# Altium schematic sheet Navigation switches.SchDoc
size A; SheetNumber: 13; SheetTotal: 14
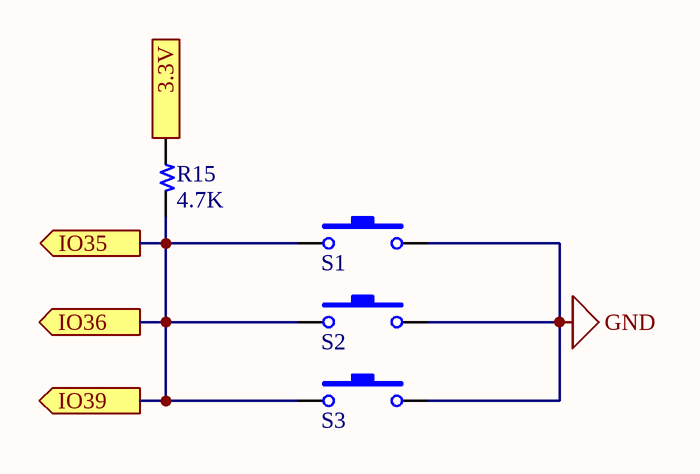
[diagram p0: Navigation switches.SchDoc]

## Parts
R15  4.7K  [R 0805]
S1  SW-SMD  [SW-SMD]  (value not drawn)
S2  SW-SMD  [SW-SMD]  (value not drawn)
S3  SW-SMD  [SW-SMD]  (value not drawn)

## Ports
3.3V (in, see ESP32[1C], Ecternal I2C[2B], MLX Sensor[2B], Programming Circuit[2B], Regulator 3.3V[3A], SD card[3B]), IO35 (out, see ESP32[2C]), IO36 (out, see ESP32[2C]), IO39 (out, see ESP32[2C])

## Nets
GND: S1.2 S2.2 S3.2
3.3V: R15.1 ; port 3.3V
IO35: R15.2 S1.1 S2.1 S3.1 ; port IO35, port IO36, port IO39

## Library data of the parts
R15 = Resistor
S1-S3 = SW-SMD: Switch; Published: 24-Mar-1999; LatestRevisionDate: 17-Jul-2002; LatestRevisionNote: Re-released for DXP Platform.; PackageReference: SPST-2; Publisher: Altium Limited